# Altium schematic sheet ADC_AFE.SchDoc: ADC AFE
size 420 x 297 mm; Author: P. Zdunek; DrawnBy: P. Zdunek; Organization: Altium Limited; Address1: L3, 12a Rodborough Rd; Address2: Frenchs Forest; Address3: NSW; Address4: Australia 2086; DocumentNumber: 9; SheetNumber: 9; SheetTotal: 37; ModifiedBy: -; CheckedDate: -; Title2: Fast Stabilizer; DivGrp: WUT ISE; Designer: G.Kasprowicz
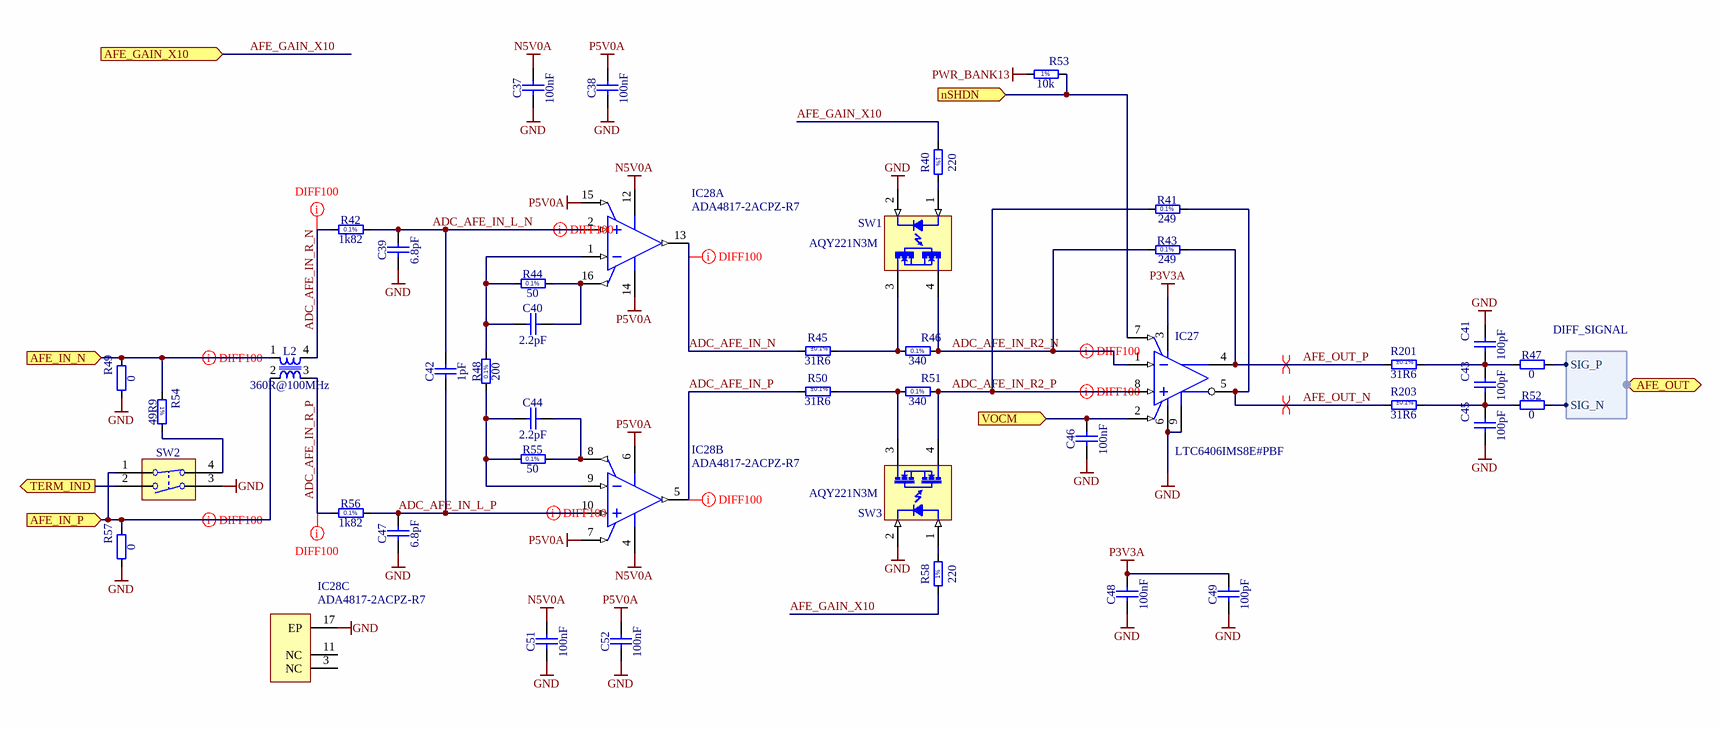
[diagram p0: ADC_AFE.SchDoc]

## Parts
C37  100nF  [CAPC1005X55N]
C38  100nF  [CAPC1005X55N]
C39  6.8pF  [CAPC1005X61N]
C40  2.2pF  [CAPC1608X87N]
C41  100pF  [CAPC1005X55N]
C42  1pF  [CAPC1005X55N]
C43  100pF  [CAPC1005X55N]
C44  2.2pF  [CAPC1608X87N]
C45  100pF  [CAPC1005X55N]
C46  100nF  [CAPC1005X55N]
C47  6.8pF  [CAPC1005X61N]
C48  100nF  [CAPC1005X55N]
C49  100pF  [CAPC1005X55N]
C51  100nF  [CAPC1005X55N]
C52  100nF  [CAPC1005X55N]
IC27  LTC6406IMS8E#PBF  [LT-MS8E-8-EDP_M]
IC28  ADA4817-2ACPZ-R7  [CP-16-4_N]  (parts A,B,C of 3)
L2  360R@100MHz  [IND_TDK_ACM2012]
R40  220  [RESC1608X55N]
R41  249  [RESC1608X55N]
R42  1k82  [RESC1608X55N]
R43  249  [RESC1608X55N]
R44  50  [RESC1005X35N]
R45  31R6  Tolerance: ±0.1%  [RESC1608X55N]
R46  340  [RESC1608X55N]
R47  0  [RESC1005X40N]
R48  200  [RESC1608X55N]
R49  0  [RESC1005X40N]
R50  31R6  Tolerance: ±0.1%  [RESC1608X55N]
R51  340  [RESC1608X55N]
R52  0  [RESC1005X40N]
R53  10k  [RESC1005X40N]
R54  49R9  [RESC6331X70N]
R55  50  [RESC1005X35N]
R56  1k82  [RESC1608X55N]
R57  0  [RESC1005X40N]
R58  220  [RESC1608X55N]
R201  31R6  Tolerance: ±0.1%  [RESC1608X55N]
R203  31R6  Tolerance: ±0.1%  [RESC1608X55N]
SW1  AQY221N3M  [PANASONIC_AQY22(SON)]
SW2  Switch  [SW_CTS_204-121ST]  (value not drawn)
SW3  AQY221N3M  [PANASONIC_AQY22(SON)]

## Ports
AFE_GAIN_X10 (in), AFE_IN_N (in), AFE_IN_P (in), AFE_OUT (bidir, harness DIFF_SIGNAL), nSHDN (in), TERM_IND (out), VOCM (in)

## Harnesses
DIFF_SIGNAL: SIG_P, SIG_N

## Nets
GND: C37.1 C38.1 C39.1 C41.2 C45.1 C46.1 C47.1 C48.1 C49.1 C51.1 C52.1 IC27.6(V-) IC27.9(EP) IC28.17(EP) R49.1 R57.1 SW1.2(K) SW2.3 SW3.2(K)
N5V0A: C37.2 C51.2 IC28.4(-VS_2) IC28.12(-VS_1)
P3V3A: C48.2 C49.2 IC27.3(V+)
P5V0A: C38.2 C52.2 IC28.6(+VS_2) IC28.7(~{PD2}) IC28.14(+VS_1) IC28.15(~{PD1})
PWR_BANK13: R53.1
ADC_AFE_IN_L_N: C39.2 C42.2 IC28.2(+IN_1) R42.2
ADC_AFE_IN_L_P: C42.1 C47.2 IC28.10(+IN_2) R56.2
ADC_AFE_IN_N: IC28.13(OUT_1) R45.1
ADC_AFE_IN_P: IC28.5(OUT_2) R50.1
ADC_AFE_IN_R2_N: IC27.1(-IN) R43.1 R46.2 SW1.4(E)
ADC_AFE_IN_R2_P: IC27.8(+IN) R41.1 R51.2 SW3.4(E)
ADC_AFE_IN_R_N: L2.4 R42.1
ADC_AFE_IN_R_P: L2.3 R56.1
AFE_GAIN_X10: R40.1 R58.1 ; port AFE_GAIN_X10
AFE_IN_N: L2.1 R49.2 R54.1 ; port AFE_IN_N
AFE_IN_P: L2.2 R57.2 SW2.1 ; port AFE_IN_P
AFE_OUT_N: IC27.5(-OUT) R41.2 R203.1
AFE_OUT_P: IC27.4(+OUT) R43.2 R201.1
nSHDN: IC27.7(~{SHDN}) R53.2 ; port nSHDN
TERM_IND: SW2.2 ; port TERM_IND
VOCM: C46.2 IC27.2(VOCM) ; port VOCM
NetC40_1: C40.1 IC28.1(-IN_1) R44.1 R48.2
NetC40_2: C40.2 IC28.16(FB1) R44.2
NetC41_1: C41.1 C43.2 R47.1 R201.2
NetC43_1: C43.1 C45.2 R52.1 R203.2
NetC44_1: C44.1 IC28.9(-IN_2) R48.1 R55.1
NetC44_2: C44.2 IC28.8(FB2) R55.2
NetR40_2: R40.2 SW1.1(A)
NetR45_2: R45.2 R46.1 SW1.3(C)
NetR47_2: R47.2 ; port AFE_OUT.SIG_P
NetR50_2: R50.2 R51.1 SW3.3(C)
NetR52_2: R52.2 ; port AFE_OUT.SIG_N
NetR54_2: R54.2 SW2.4
NetR58_2: R58.2 SW3.1(A)

Not connected (* = marked no-connect by the designer): IC28 3(NC) 11(NC)

## Layout directives
differential pair: ADC_AFE_IN_L_N, ADC_AFE_IN_L_P, ADC_AFE_IN_N, ADC_AFE_IN_P, ADC_AFE_IN_R2_N, ADC_AFE_IN_R2_P, ADC_AFE_IN_R_N, ADC_AFE_IN_R_P, AFE_IN_N, AFE_IN_P, AFE_OUT_N, AFE_OUT_P

## Notes on the sheet
- Project/Equipment
- Document
- Designer
- Drawn by
- Check.by
- Copyright WUT ISE 2020.
  This documentation describes Open Hardware and is licensed under the CERN OHL v.1.2. You may redistribute and modify this documentation under the terms of the CERN OHL v.1.2. (http://ohwr.org/CERNOHL). This documentation is distributed WITHOUT ANY EXPRESS OR IMPLIED WARRANTY, INCLUDING OF MERCHANTABILITY, SATISFACTORY QUALITY AND FITNESS FOR A PARTICULAR PURPOSE. Please see the CERN OHL v.1.2 for applicable conditions.
- Contact
- File
- Last Mod.
- Print Date
- Sheet
- Size
- A3
- of
- Rev
- (in symbol R0402_10K_1%_0.0625W_100PPM) 1%
- (in symbol R0402_50R_0.1%_0.05W_25PPM) 0.1%
- (in symbol R0603_1K82_0.1%_0.063W_10PPM) 0.1%
- (in symbol R0603_200R_0.1%_0.063W_10PPM) 0.1%
- (in symbol R0603_220R_1%_0.1W_100PPM) 1%
- (in symbol R0603_249R_0.1%_0.063W_10PPM) 0.1%
- (in symbol R0603_340R_0.1%_0.063W_10PPM) 0.1%
- (in symbol R2512_49R9_1%_1W_100PPM_VISHAY_CRCW) 1%

## Library data of the parts
C37 C38 C46 C48 C51 C52 = CC0402_100NF_16V_10%_X7R: Non-polarised capacitor; Part Description: SMD Multilayer Chip Ceramic Capacitor; Manufacturer: GENERIC; Manufacturer1 Part Number: GRM155R71C104KA88D; Voltage: 16V; TC: X7R; Tolerance: ±10%; Part Number: CC0402_100NF_16V_10%_X7R; Component Kind: Standard; Component Type: Standard; Pin Count: 2; Value: 100nF; Status: Not Recommended; Manufacturer Part Number: CC0402_100NF_16V_10%_X7R; Case: 0402; Mounted: Yes; Socket: No; SMD: Yes; Sense: No; Manufacturer1 Example: MURATA; Manufacturer1 ComponentHeight: 0.55mm; HelpURL: \\cern.ch\dfs\Applications\Altium\Datasheets\CC0402_X7R_MURATA_GRM.pdf; Author: CERN DEM JLC; CreateDate: 05-Dec-13; LatestRevisionDate: 03-Dec-07
C39 C47 = CC0402_6.8PF_50V_0.1PF_NP0_JOHANSON_R07S: Non-polarised capacitor; Part Description: Ultra High-Q SMD Multilayer Capacitor; Manufacturer: JOHANSON TECHNOLOGY; Manufacturer Part Number: 500R07S6R8BV4T; Voltage: 50V; TC: C0G/NP0; Tolerance: ±0.1pF; Part Number: CC0402_6.8PF_50V_0.1PF_NP0_JOHANSON_R07S; Component Kind: Standard; Component Type: Standard; Pin Count: 2; Value: 6.8pF; Status: Not Recommended; Case: 0402; Mounted: Yes; Socket: No; SMD: Yes; Sense: No; HelpURL: \\cern.ch\dfs\Applications\Altium\Datasheets\CC0402_NP0_JOHANSON_R07S.pdf; Author: CERN DEM BC; CreateDate: 17-Nov-17; LatestRevisionDate: 26-Sep-18; ComponentHeight: 0.61mm
C40 C44 = CC0603_2.2PF_50V_0.25PF_NP0: Non-polarised capacitor; Part Description: SMD Multilayer Chip Ceramic Capacitor; Manufacturer: GENERIC; Manufacturer1 Part Number: 223886715228; Voltage: 50V; TC: C0G/NP0; Tolerance: ±0.25pF; Part Number: CC0603_2.2PF_50V_0.25PF_NP0; Component Kind: Standard; Component Type: Standard; Pin Count: 2; Value: 2.2pF; Status: Preferred; Manufacturer Part Number: CC0603_2.2PF_50V_0.25PF_NP0; Case: 0603; Mounted: Yes; Socket: No; SMD: Yes; Sense: No; Manufacturer1 Example: PHYCOMP; Manufacturer1 ComponentHeight: 0.87mm; HelpURL: \\cern.ch\dfs\Applications\Altium\Datasheets\CC0603_NP0_PHYCOMP.pdf; Author: CERN DEM JLC; CreateDate: 03-Dec-07; LatestRevisionDate: 03-Dec-07
C41 C43 C45 C49 = CC0402_100PF_50V_2%_C0G: Non-polarised capacitor; Part Description: SMD Multilayer Chip Ceramic Capacitor; Manufacturer: GENERIC; Manufacturer Part Number: CC0402_100PF_50V_5%_C0G; Manufacturer1 Part Number: C0402C101G5GAC; Voltage: 50V; TC: C0G/NP0; Tolerance: ±2%; Part Number: CC0402_100PF_50V_2%_C0G; Component Kind: Standard; Component Type: Standard; Pin Count: 2; Value: 100pF; Status: Preferred; Case: 0402; Mounted: Yes; Socket: No; SMD: Yes; Sense: No; Manufacturer1 Example: KEMET; Manufacturer1 ComponentHeight: 0.55mm; HelpURL: \\cern.ch\dfs\Applications\Altium\Datasheets\CC0402_C0G_KEMET_(Commercial Grade).pdf; Author: CERN DEM BC; CreateDate: 15.06.2020; LatestRevisionDate: 15.06.2020
C42 = CC0402_1PF_50V_0.25PF_C0G: Non-polarised capacitor; Part Description: SMD Multilayer Chip Ceramic Capacitor; Manufacturer: GENERIC; Manufacturer1 Part Number: C0402C109C5GACTU; Voltage: 50V; TC: C0G/NP0; Tolerance: ±0.25pF; Part Number: CC0402_1PF_50V_0.25PF_C0G; Component Kind: Standard; Component Type: Standard; Pin Count: 2; Value: 1pF; Status: Preferred; Manufacturer Part Number: CC0402_1PF_50V_0.25PF_C0G; Case: 0402; Mounted: Yes; Socket: No; SMD: Yes; Sense: No; Manufacturer1 Example: KEMET; Manufacturer1 ComponentHeight: 0.55mm; HelpURL: \\cern.ch\dfs\Applications\Altium\Datasheets\CC0805_C0G_KEMET_(Commercial Grade).pdf; Author: CERN DEM JLC; CreateDate: 03-Dec-07; LatestRevisionDate: 22-Apr-15
IC27 = CMP-0359-00998-2: Single Channel, Low Noise, Differential Amplifier / Driver, RRI, 3000 MHz Typical GBW, 630 V/us Typical SR, 2.7 to 3.5 V, 8-Pin SOP (MS8E-8), Industrial, Pb-Free; Manufacturer: Linear Technology; GBW (MHz) Typical: 3000; Vs Max (V): 3.5; Vos (mV) Typical: 1; Vs Min (V): 2.7; Is (mA) Typical: 18; SR (V/us) Typical: 630; PackageVersion: Rev J; Linear Technology Part Number: LTC6406; RoHS: Pb-Free; ComponentLink1Description: Manufacturer URL; Type: DIFF; PackageReference: LT-MS8E-8-EDP; PartNumber: LTC6406IMS8E#PBF; DatasheetVersion: Rev. C; Mounting Technology: Surface Mount; ComponentLink1URL: http://www.linear.com/; ComponentLink2URL: http://cds.linear.com/docs/en/datasheet/6406fc.pdf; ComponentLink2Description: Datasheet; RevisionNote: URLs updated; PackageDescription: 8-Lead Plastic MSOP, Body 3.00 x 3.00 mm. Pitch 0.65 mm; Channels (#): 1; ComponentLink3URL: http://cds.linear.com/docs/en/packaging/05081662_J_MS8E.pdf; ComponentLink3Description: Package Specification
IC28 = CMP-0384-02092-2: Double Channel Low Noise Operational Amplifier, 1.05 GHz BW, 870 V/us SR, Industrial, 16-pin QFN (CP-16-4), Reel; Manufacturer: Analog Devices; Input Bias Current: 2pA; V Span Max: 10V; Amplifiers Per Package: 2; Iq/Amp: 21mA; V Span Min: 5V; Input Offset Voltage: 2mV; Small Signal Bandwidth: 1.05GHz; DatasheetVersion: Rev. A; Generic Part Number: ADA4817-2; RevisionNote: Reference Circuit URL fixed; ComponentLink2URL: http://www.analog.com/static/imported-files/data_sheets/ADA4817-1_4817-2.pdf; ComponentLink2Description: Datasheet; ComponentLink1Description: Manufacturer URL; Slew Rate: 870V/us; ComponentLink1URL: http://www.analog.com/en/index.html; ComponentLink3URL: http://www.analog.com/static/imported-files/packages/46009454504174339653421710019CP_16_4.pdf; ComponentLink4URL: http://www.analog.com/en/all-operational-amplifiers-op-amps/operational-amplifiers-op-amps/ada4817-2/products/product.html#product-recommendations; PackageReference: CP-16-4; ComponentLink3Description: Package Specification; PackageDescription: 16-Pin Lead Frame Chip Scale Package, Body 4 x 4 mm, Pitch 0.65 mm; Mounting Technology: Surface Mount; Code_JEDEC: MO-220-VGGC; ComponentLink4Description: Reference Circuit; PartNumber: ADA4817-2ACPZ-R7; PackageVersion: 010606-0
L2 = IND_TDK_ACM2012-361-2P: Inductor Common Mode; Part Description: Common Mode Filters For High-Speed Differential Signal Line, TDK ACM2012 Series; Manufacturer: TDK; Power: 220mA; Resistance: 0R5; Part Number: IND_TDK_ACM2012-361-2P; Component Kind: Standard; Component Type: Standard; Pin Count: 2; Value: 360R@100MHz; Status: None; Manufacturer Part Number: ACM2012-361-2P; Mounted: Yes; Socket: No; SMD: Yes; Sense: No; ComponentHeight: 1.3mm; HelpURL: \\cern.ch\dfs\Applications\Altium\Datasheets\IND_TDK_ACM2012.pdf; Author: CERN DEM BC; CreateDate: 07/07/2020; LatestRevisionDate: 07/07/2020
R40 R58 = R0603_220R_1%_0.1W_100PPM: Resistor - 1%; Manufacturer1 Part Number: NRC06F2200TRF; Manufacturer: GENERIC; Part Description: General Purpose Thick Film Chip Resistor; Power: 0.1W; Table: Resistors SMD; TC: ±100ppm/°C; PressFit: No; Author: CERN DEM JLC; Case: 0603; Component Type: Standard; CreateDate: 03/12/2007; HelpURL: \\cern.ch\dfs\Applications\Altium\Datasheets\R0603_NIC_NRC.pdf; LatestRevisionDate: 13/03/2008; Manufacturer1 ComponentHeight: 0.55mm; Manufacturer1 Example: NIC COMPONENT; Manufacturer Part Number: R0603_220R_1%_0.1W_100PPM; Mounted: Yes; Pin Count: 2; SMD: Yes; Socket: No; Status: Preferred; Tolerance: ±1%; Value: 220; Part Number: R0603_220R_1%_0.1W_100PPM; Component Kind: Standard; Sense: No
R41 R43 = R0603_249R_0.1%_0.063W_10PPM: Resistor - 0.1%; Part Description: Thin Film Chip Resistor; Manufacturer: GENERIC; Manufacturer1 Part Number: RN73C1J249RBTDF; Power: 0.063W; TC: ±10ppm; PressFit: No; Part Number: R0603_249R_0.1%_0.063W_10PPM; Component Kind: Standard; Component Type: Standard; Pin Count: 2; Value: 249; Status: Not Recommended; Tolerance: ±0.1%; Manufacturer Part Number: R0603_249R_0.1%_0.063W_10PPM; Case: 0603; Mounted: Yes; Sense: No; Socket: No; SMD: Yes; Manufacturer1 Example: TYCO HOLSWORTHY; Manufacturer1 ComponentHeight: 0.5mm; HelpURL: \\cern.ch\dfs\Applications\Altium\Datasheets\R0603_Tyco_RN73.pdf; Author: CERN DEM JLC; CreateDate: 03-Dec-07; LatestRevisionDate: 13-Mar-08
R42 R56 = R0603_1K82_0.1%_0.063W_10PPM: Resistor - 0.1%; Part Description: Thin Film Chip Resistor; Manufacturer: GENERIC; Manufacturer1 Part Number: RN73C1J1K82BTDF; Power: 0.063W; TC: ±10ppm; PressFit: No; Part Number: R0603_1K82_0.1%_0.063W_10PPM; Component Kind: Standard; Component Type: Standard; Pin Count: 2; Value: 1k82; Status: Not Recommended; Tolerance: ±0.1%; Manufacturer Part Number: R0603_1K82_0.1%_0.063W_10PPM; Case: 0603; Mounted: Yes; Sense: No; Socket: No; SMD: Yes; Manufacturer1 Example: TYCO HOLSWORTHY; Manufacturer1 ComponentHeight: 0.5mm; HelpURL: \\cern.ch\dfs\Applications\Altium\Datasheets\R0603_Tyco_RN73.pdf; Author: CERN DEM JLC; CreateDate: 03/12/2007; LatestRevisionDate: 13/03/2008
R44 R55 = R0402_50R_0.1%_0.05W_25PPM: Resistor - 0.1%; Part Description: Thin Film Precision Resistor; Manufacturer: GENERIC; Manufacturer1 Part Number: FC0402E50R0BTBS; Power: 0.05W; TC: ±25ppm/°C; PressFit: No; Part Number: R0402_50R_0.1%_0.05W_25PPM; Component Kind: Standard; Component Type: Standard; Pin Count: 2; Value: 50; Status: Not Recommended; Tolerance: ±0.1%; Manufacturer Part Number: R0402_50R_0.1%_0.05W_25PPM; Case: 0402; Mounted: Yes; Sense: No; Socket: No; SMD: Yes; Manufacturer1 Example: VISHAY DALE; Manufacturer1 ComponentHeight: 0.38mm; HelpURL: \\cern.ch\dfs\Applications\Altium\Datasheets\R0402_VISHAY_FC.pdf; Author: CERN DEM JMW; CreateDate: 11-Aug-16; LatestRevisionDate: 11-Aug-16
R45 R50 R201 R203 = R0603_31R6_0.1%_0.063W_10PPM: Resistor - 0.1%; Part Description: Thin Film Chip Resistor; Manufacturer: GENERIC; Manufacturer1 Part Number: RN73C1J31R6BTDF; Power: 0.063W; TC: ±10ppm; PressFit: No; Part Number: R0603_31R6_0.1%_0.063W_10PPM; Component Kind: Standard; Component Type: Standard; Pin Count: 2; Value: 31R6; Status: Not Recommended; Manufacturer Part Number: R0603_31R6_0.1%_0.063W_10PPM; Case: 0603; Mounted: Yes; Sense: No; Socket: No; SMD: Yes; Manufacturer1 Example: TYCO HOLSWORTHY; Manufacturer1 ComponentHeight: 0.5mm; HelpURL: \\cern.ch\dfs\Applications\Altium\Datasheets\R0603_Tyco_RN73.pdf; Author: CERN DEM JLC; CreateDate: 03.12.2007; LatestRevisionDate: 13.03.2008
R46 R51 = R0603_340R_0.1%_0.063W_10PPM: Resistor - 0.1%; Part Description: Thin Film Chip Resistor; Manufacturer: GENERIC; Manufacturer1 Part Number: RN73C1J340RBTDF; Power: 0.063W; TC: ±10ppm; PressFit: No; Part Number: R0603_340R_0.1%_0.063W_10PPM; Component Kind: Standard; Component Type: Standard; Pin Count: 2; Value: 340; Status: Not Recommended; Tolerance: ±0.1%; Manufacturer Part Number: R0603_340R_0.1%_0.063W_10PPM; Case: 0603; Mounted: Yes; Sense: No; Socket: No; SMD: Yes; Manufacturer1 Example: TYCO HOLSWORTHY; Manufacturer1 ComponentHeight: 0.5mm; HelpURL: \\cern.ch\dfs\Applications\Altium\Datasheets\R0603_Tyco_RN73.pdf; Author: CERN DEM JLC; CreateDate: 03/12/2007; LatestRevisionDate: 13/03/2008
R47 R49 R52 R57 = R0402_0R_JUMPER: Resistor; Part Description: 1A (0.05R Max DC Resistance) Zero Ohm Jumper; Manufacturer: GENERIC; Manufacturer1 Part Number: 232270591001L; PressFit: No; Part Number: R0402_0R_JUMPER; Component Kind: Standard; Component Type: Standard; Pin Count: 2; Value: 0; Status: Not Recommended; Manufacturer Part Number: R0402_0R_JUMPER; Case: 0402; Mounted: Yes; Sense: No; Socket: No; SMD: Yes; Manufacturer1 Example: YAGEO PHYCOMP; Manufacturer1 ComponentHeight: 0.4mm; HelpURL: \\cern.ch\dfs\Applications\Altium\Datasheets\R0402_Phycomp_RC0402.pdf; Author: CERN DEM JLC
  R47 R52: CreateDate: 03-Dec-07; LatestRevisionDate: 17-Oct-12
  R49 R57: CreateDate: 03/12/2007; LatestRevisionDate: 17/10/2012
R48 = R0603_200R_0.1%_0.063W_10PPM: Resistor - 0.1%; Part Description: Thin Film Chip Resistor; Manufacturer: GENERIC; Manufacturer1 Part Number: RN73C1J200RBTDF; Power: 0.063W; TC: ±10ppm; PressFit: No; Part Number: R0603_200R_0.1%_0.063W_10PPM; Component Kind: Standard; Component Type: Standard; Pin Count: 2; Value: 200; Status: Not Recommended; Tolerance: ±0.1%; Manufacturer Part Number: R0603_200R_0.1%_0.063W_10PPM; Case: 0603; Mounted: Yes; Sense: No; Socket: No; SMD: Yes; Manufacturer1 Example: TYCO HOLSWORTHY; Manufacturer1 ComponentHeight: 0.5mm; HelpURL: \\cern.ch\dfs\Applications\Altium\Datasheets\R0603_Tyco_RN73.pdf; Author: CERN DEM JLC; CreateDate: 03-Dec-07; LatestRevisionDate: 13-Mar-08
R53 = R0402_10K_1%_0.0625W_100PPM: Resistor - 1%; Part Description: General Purpose Thick Film Chip Resistor; Manufacturer: GENERIC; Manufacturer1 Part Number: 232270671003L; TC: ±100ppm/°C; PressFit: No; Part Number: R0402_10K_1%_0.0625W_100PPM; Component Kind: Standard; Component Type: Standard; Pin Count: 2; Value: 10k; Status: Not Recommended; Power: 0.0625W; Tolerance: ±1%; Manufacturer Part Number: R0402_10K_1%_0.0625W_100PPM; Case: 0402; Mounted: Yes; Sense: No; Socket: No; SMD: Yes; Manufacturer1 Example: YAGEO PHYCOMP; Manufacturer1 ComponentHeight: 0.4mm; HelpURL: \\cern.ch\dfs\Applications\Altium\Datasheets\R0402_Phycomp_RC0402.pdf; Author: CERN DEM JLC; CreateDate: 03.12.2007; LatestRevisionDate: 17.10.2012
R54 = R2512_49R9_1%_1W_100PPM_VISHAY_CRCW: Resistor - 1%; Part Description: Thick Film Chip Resistor; Manufacturer: VISHAY DRALORIC; Manufacturer Part Number: CRCW251249R9FKEG; Power: 1W; TC: ±100ppm/°C; PressFit: No; Part Number: R2512_49R9_1%_1W_100PPM_VISHAY_CRCW; Component Kind: Standard; Component Type: Standard; Pin Count: 2; Value: 49R9; Status: None; Tolerance: ±1%; Case: 2512; Mounted: Yes; Sense: No; Socket: No; SMD: Yes; ComponentHeight: 0.7mm; HelpURL: \\cern.ch\dfs\Applications\Altium\Datasheets\R2512_VISHAY_CRCW2512.pdf; Author: CERN DEM JLC; CreateDate: 22.05.2012; LatestRevisionDate: 22.05.2012
SW1 SW3 = AQY221N3M: PhotoMOS Relay; Part Description: RF SON 1 Form A, PhotoMOS Relay, CxR5 (On Res. 5.5Ohm, Out Cap. 1.1pF), 25V 150mA; Manufacturer: PANASONIC; Table: Optocouplers; Bonding: No; PressFit: No; Part Number: AQY221N3M; Component Kind: Standard; Component Type: Standard; Device: AQY221N3M; PackageDescription: PANASONIC Serie AQY22(SON)  Small Outline No Lead, 4 pins, 2.2x2.95mm; Manufacturer Part Number: AQY221N3M; Pin Count: 4; Case: SON4; Mounted: Yes; Socket: No; SMD: Yes; ComponentHeight: 1.4mm; HelpURL: \\cern.ch\dfs\Applications\Altium\Datasheets\AQY221N3M.pdf; ComponentLink1Description: Package Drawing; ComponentLink1URL: \\cern.ch\dfs\Applications\Altium\Datasheets\AQY221N3M_Package-Drawing.pdf; Author: CERN DEM JLC; CreateDate: 18/01/2010; LatestRevisionDate: 05/12/2018; Sense: No
SW2 = SW_CTS_204-121ST: 2x SPST DIP Switch 1NO + 1NF; Part Description: Coupled SPST DIP Switch, 1NO + 1NF, CTS 204 Series; Manufacturer: CTS; PressFit: No; Part Number: SW_CTS_204-121ST; Component Kind: Standard; Component Type: Standard; Pin Count: 4; PackageDescription: Body 7.26 x 9.78mm, 2x SPST DIP, 1NO + 1NF Switch, CTS 204 Series; Family: Switch; Mounted: Yes; Socket: No; SMD: Yes; Sense: No; Status: None; Manufacturer Part Number: 204-121ST; ComponentHeight: 10.36mm; HelpURL: \\cern.ch\dfs\Applications\Altium\Datasheets\SW_CTS_204-121ST.pdf; Author: CERN DEM JLC; CreateDate: 28.08.2014; LatestRevisionDate: 28.08.2014